# EAGLE board fmc-host (EAGLE 8.3.2), part 1 of 3
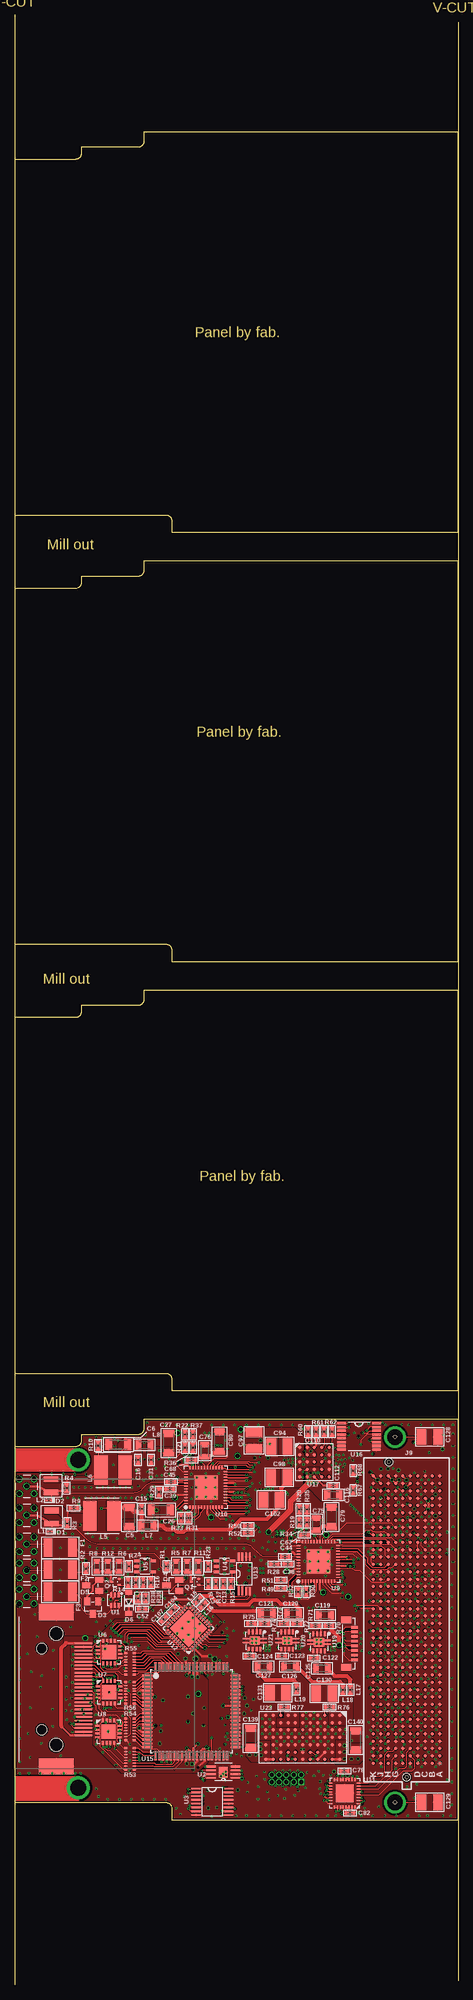
[diagram p9: board, top side]
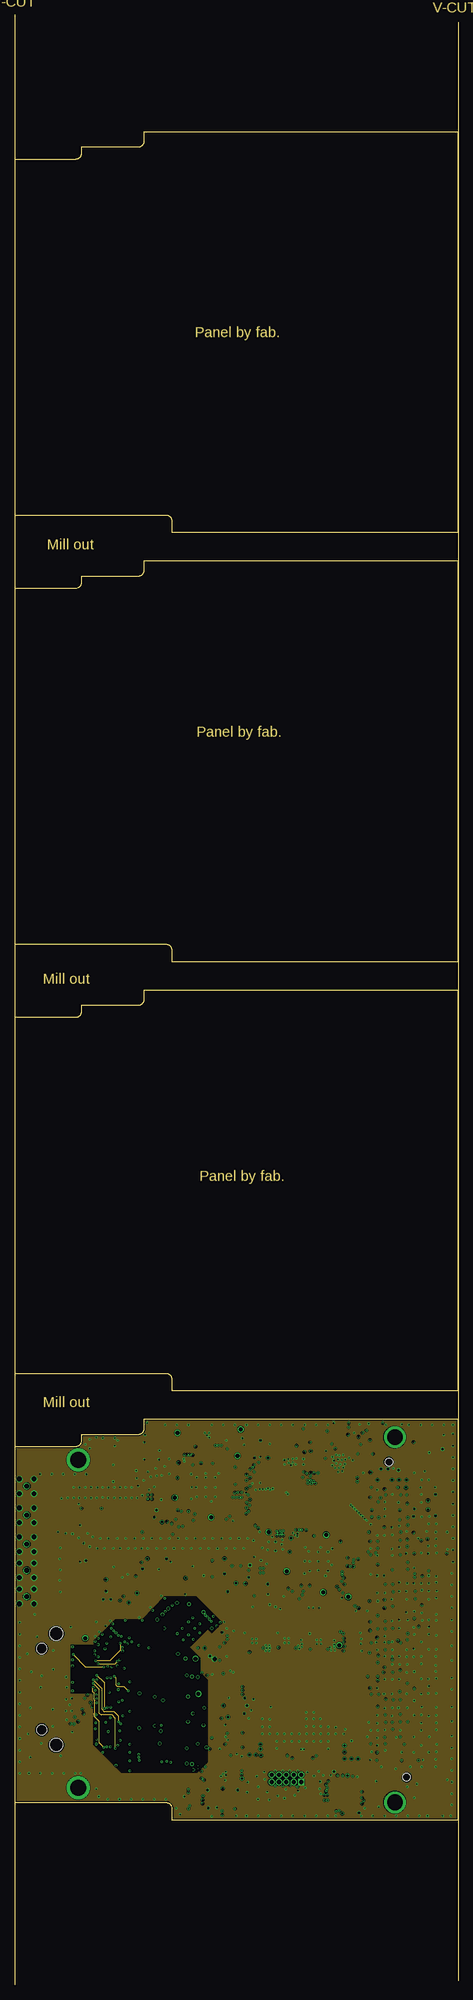
[diagram p10: board, inner layer GND1]
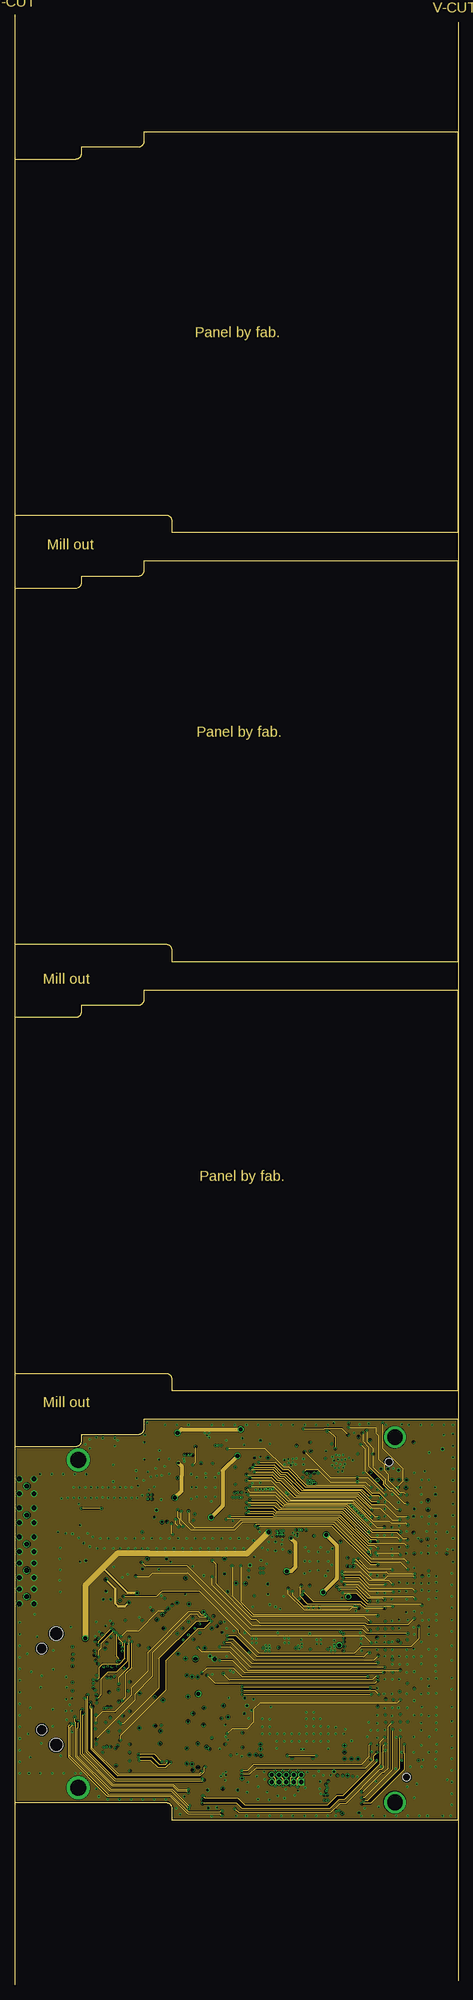
[diagram p11: board, inner layer Highspeed2]
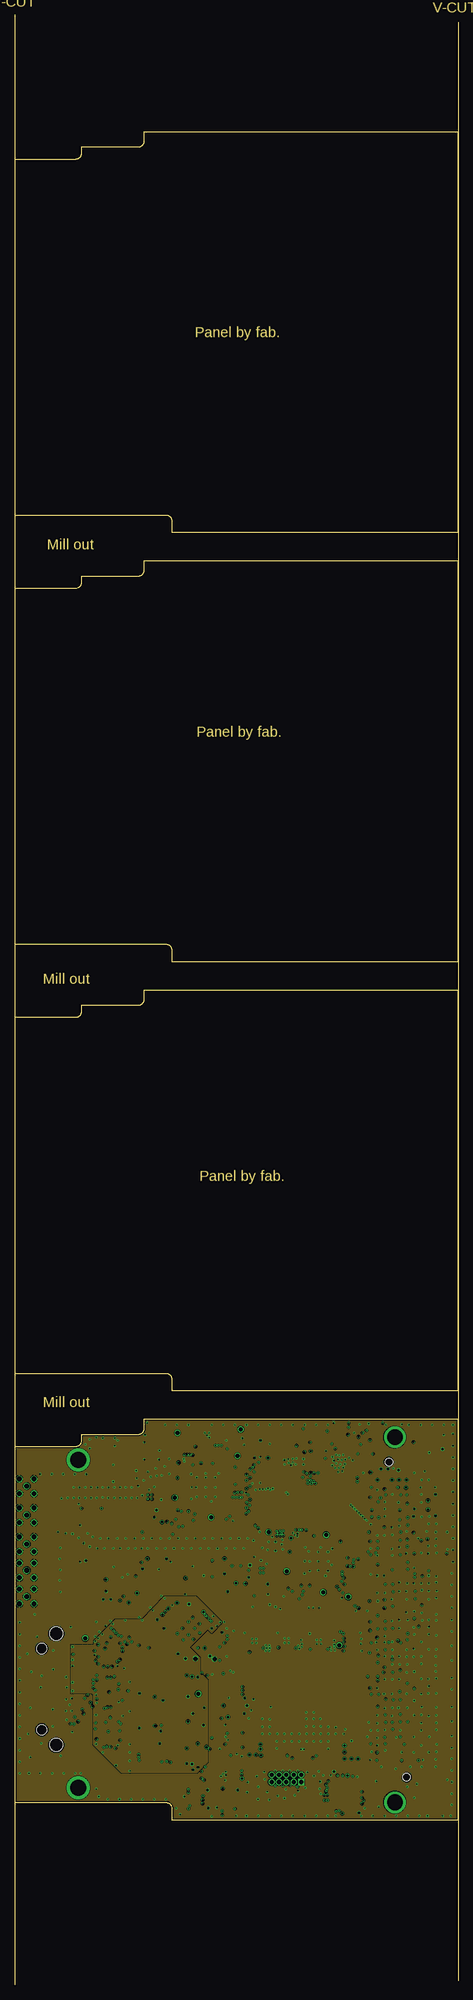
[diagram p12: board, inner layer GND3]
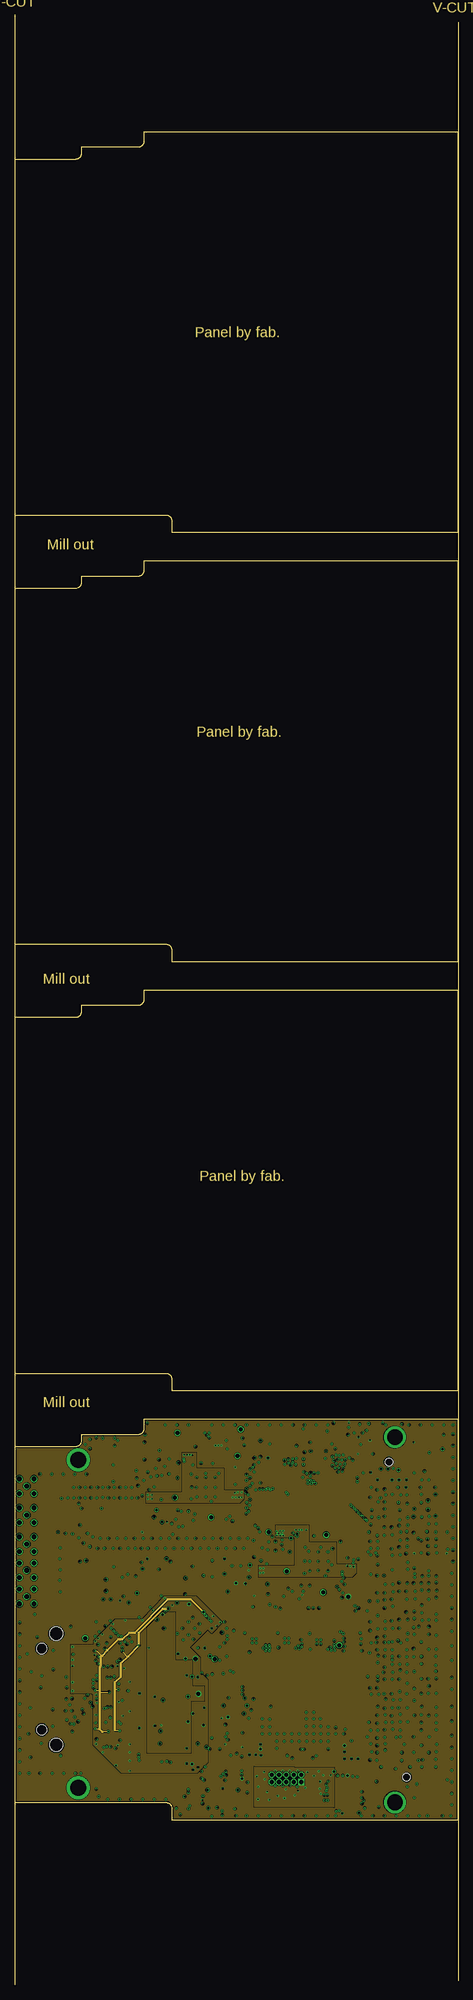
[diagram p13: board, inner layer VCC]
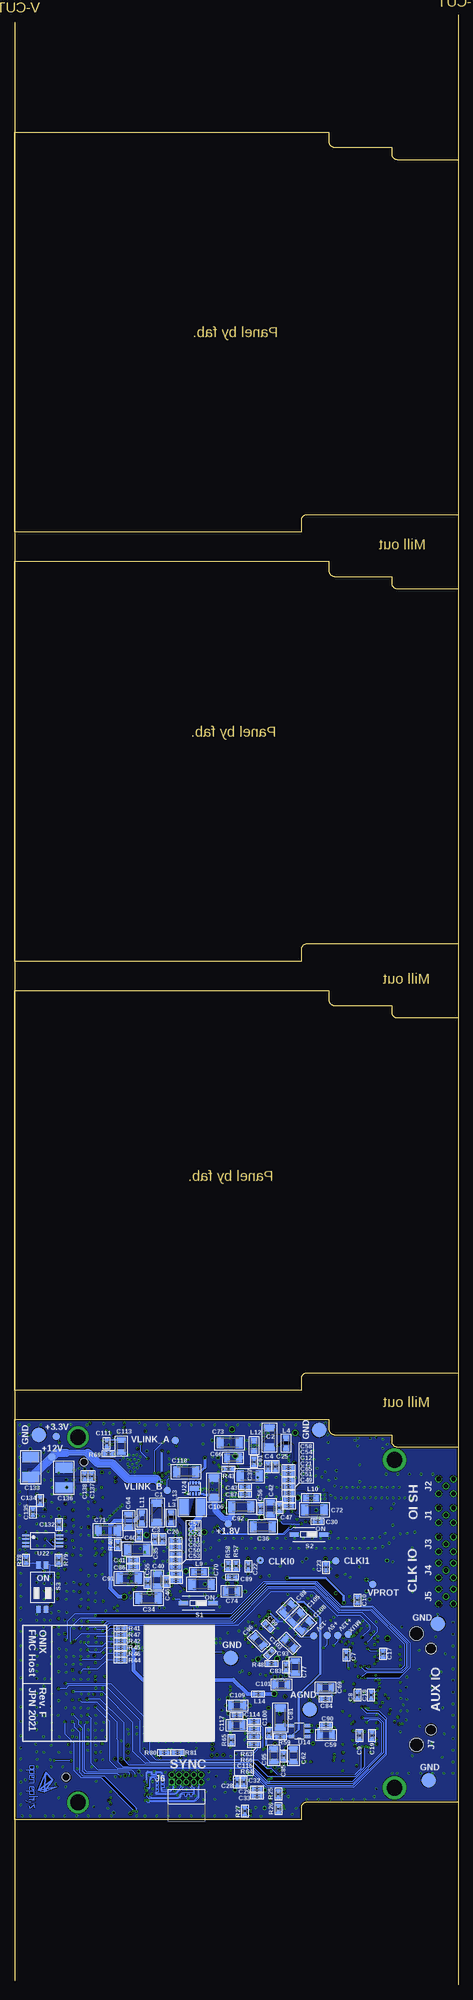
[diagram p14: board, bottom side, seen from below]

Size 76.5 x 339.8 mm. Coordinates in mm from the lower left corner, seen from the top.
Outline: 0,339.8 0,0
Outline: 76.5,338.5 76.5,0.7
Outline: 76.5,102.5 76.5,171.5 22.3,171.5 22.3,169.9 arc-90 21.3,168.9 11.5,168.9 11.5,167.8 arc-90 10.5,166.8 0,166.8 0,105.5 26.1,105.5 arc-90 27.1,104.5 27.1,102.5 76.5,102.5
Outline: 76.5,176.5 76.5,245.5 22.3,245.5 22.3,243.9 arc-90 21.3,242.9 11.5,242.9 11.5,241.8 arc-90 10.5,240.8 0,240.8 0,179.5 26.1,179.5 arc-90 27.1,178.5 27.1,176.5 76.5,176.5
Outline: 76.5,250.5 76.5,319.5 22.3,319.5 22.3,317.9 arc-90 21.3,316.9 11.5,316.9 11.5,315.8 arc-90 10.5,314.8 0,314.8 0,253.5 26.1,253.5 arc-90 27.1,252.5 27.1,250.5 76.5,250.5
Copper layers (1+2*3+4*5+16): Top/HighSpeed 0.035mm / dielectric 0.1mm / GND1 0.0175mm / dielectric 0.565mm / Highspeed2 0.0175mm / dielectric 5mil / GND3 0.0175mm / dielectric 0.565mm / VCC 0.0175mm / dielectric 0.1mm / Bottom/LowSpeed 0.035mm
Design rules "jlcpcb-6-layer *": minimum track width 3.5mil, minimum drill 0.2mm, track to track 3.5mil, track to pad 3.5mil, pad to pad 3.5mil, via to via 5mil, smd to smd 0mil, copper to edge 0.2mm, drill to drill 5mil, minimum pad ring 3mil, minimum via ring 3mil, stop-mask expansion 0mil, vias tented up to drill 100mil, thermal gap 0.12mm
Net classes: 1 130 Ohm Diff Top: width 0.09 mm, drill 0.2 mm, clearance 0.089 mm; 2 50 Ohm Single Top: width 0.15 mm, drill 0.2 mm; 3 100 Ohm Diff Mid: width 0.19 mm, drill 0.2 mm, clearance 0.09 mm; 4 50 Ohm Single Mid: width 0.2 mm, drill 0.2 mm; 5 100 Ohm Diff Top: width 0.15 mm, drill 0.2 mm, clearance 0.09 mm; 6 Link: width 0.15 mm, drill 0.2 mm, clearance 0.5 mm; 7 CAN 210 Diff Top: width 0.11 mm, drill 0.2 mm, clearance 0.09 mm
tRestrict: area -0.1,31.4 to 11.2,36.2; area 8.8,31.8 to 13.2,36.2; area 8.9,88.4 to 13.1,92.6; area -0.1,88.4 to 11.2,92.8; area 63.6,29.5 to 67.6,33.5; area 63.6,92.5 to 67.6,96.5

## Footprints (pad centres in the part's own frame; a part is rotated, then mirrored left to right if it is on the bottom)
1206 = smd 1.219 x 1.88: 1 -1.651,0; 2 1.651,0
0402 = smd 0.686 x 0.762: 1 -0.533,0; 2 0.533,0
0805 = smd 0.965 x 1.524: 1 -1.041,0; 2 1.041,0
1210 = smd 1.651 x 2.794: 1 -1.397,0; 2 1.397,0
1411-VISHAY-B = smd 1.8 x 3: A -1.725,0; C 1.725,0
0402P-DFN = smd 0.35 x 0.6: A -0.325,0; C 0.325,0
SOT23 = smd 1 x 1.4: 1 -0.95,-1.1; 2 0.95,-1.1; 3 0,1.1
SOD123 = smd 0.914 x 1.219: A -1.8,0; C 1.8,0
1812 = smd 1.5 x 3.2: 1 -2.1,0; 2 2.1,0
MMCX-THRU = drill 0.8: GND@1 -1.27,1.27; GND@2 -1.27,-1.27; GND@3 1.27,-1.27; GND@4 1.27,1.27; SIG 0,0
FTSH-105-01-F-D-RA-K = drill 0.71 pad 1.06 square: 01 2.54,0.635 | drill 0.71 pad 1.06: 02 2.54,-0.635; 03 1.27,0.635; 04 1.27,-0.635; 05 0,0.635; 06 0,-0.635; 07 -1.27,0.635; 08 -1.27,-0.635; 09 -2.54,0.635; 10 -2.54,-0.635
12226-82X0-00XX = smd 0.335 x 3: 1 7.938,7.2; 2 6.668,7.2; 3 5.397,7.2; 4 4.128,7.2; 5 2.857,7.2; 6 1.587,7.2; 7 0.318,7.2; 8 -0.953,7.2; 9 -2.223,7.2; 10 -3.493,7.2; 11 -4.763,7.2; 12 -6.032,7.2; 13 -7.303,7.2; 14 7.303,7.2; 15 6.032,7.2; 16 4.763,7.2; 17 3.493,7.2; 18 2.223,7.2; 19 0.953,7.2; 20 -0.318,7.2; 21 -1.587,7.2; 22 -2.857,7.2; 23 -4.128,7.2; 24 -5.397,7.2; 25 -6.668,7.2; 26 -7.938,7.2 | smd 2.8 x 6: PAD1 -13.3,2.5; PAD2 13.3,2.5 | hole 1.8: 7,0; -7,0 | hole 2.3: 9.6,2.5; -9.6,2.5
FMC_SINGLE_WIDTH_MODULE = drill 2.7 pad 4: BEZ1 -54.6,59.05; BEZ2 -54.6,2.5
FMC_HPC_MALE = smd 0.635 x 0.635: A1 24.765,5.715; A2 23.495,5.715; A3 22.225,5.715; A4 20.955,5.715; A5 19.685,5.715; A6 18.415,5.715; A7 17.145,5.715; A8 15.875,5.715; A9 14.605,5.715; A10 13.335,5.715; A11 12.065,5.715; A12 10.795,5.715; A13 9.525,5.715; A14 8.255,5.715; A15 6.985,5.715; A16 5.715,5.715; A17 4.445,5.715; A18 3.175,5.715; A19 1.905,5.715; A20 0.635,5.715; A21 -0.635,5.715; A22 -1.905,5.715; A23 -3.175,5.715; A24 -4.445,5.715; A25 -5.715,5.715; A26 -6.985,5.715; A27 -8.255,5.715; A28 -9.525,5.715; A29 -10.795,5.715; A30 -12.065,5.715; A31 -13.335,5.715; A32 -14.605,5.715; A33 -15.875,5.715; A34 -17.145,5.715; A35 -18.415,5.715; A36 -19.685,5.715; A37 -20.955,5.715; A38 -22.225,5.715; A39 -23.495,5.715; A40 -24.765,5.715; B1 24.765,4.445; B2 23.495,4.445; B3 22.225,4.445; B4 20.955,4.445; B5 19.685,4.445; B6 18.415,4.445; B7 17.145,4.445; B8 15.875,4.445; B9 14.605,4.445; B10 13.335,4.445; B11 12.065,4.445; B12 10.795,4.445; B13 9.525,4.445; B14 8.255,4.445; B15 6.985,4.445; B16 5.715,4.445; B17 4.445,4.445; B18 3.175,4.445; B19 1.905,4.445; B20 0.635,4.445; B21 -0.635,4.445; B22 -1.905,4.445; B23 -3.175,4.445; B24 -4.445,4.445; B25 -5.715,4.445; B26 -6.985,4.445; B27 -8.255,4.445; B28 -9.525,4.445; B29 -10.795,4.445; B30 -12.065,4.445; B31 -13.335,4.445; B32 -14.605,4.445; B33 -15.875,4.445; B34 -17.145,4.445; B35 -18.415,4.445; B36 -19.685,4.445; B37 -20.955,4.445; B38 -22.225,4.445; B39 -23.495,4.445; B40 -24.765,4.445; C1 24.765,3.175; C2 23.495,3.175; C3 22.225,3.175; C4 20.955,3.175; C5 19.685,3.175; C6 18.415,3.175; C7 17.145,3.175; C8 15.875,3.175; C9 14.605,3.175; C10 13.335,3.175; C11 12.065,3.175; C12 10.795,3.175; C13 9.525,3.175; C14 8.255,3.175; C15 6.985,3.175; C16 5.715,3.175; C17 4.445,3.175; C18 3.175,3.175; C19 1.905,3.175; C20 0.635,3.175; C21 -0.635,3.175; C22 -1.905,3.175; C23 -3.175,3.175; C24 -4.445,3.175; C25 -5.715,3.175; C26 -6.985,3.175; C27 -8.255,3.175; C28 -9.525,3.175; C29 -10.795,3.175; C30 -12.065,3.175; C31 -13.335,3.175; C32 -14.605,3.175; C33 -15.875,3.175; C34 -17.145,3.175; C35 -18.415,3.175; C36 -19.685,3.175; C37 -20.955,3.175; C38 -22.225,3.175; C39 -23.495,3.175; C40 -24.765,3.175; D1 24.765,1.905; D2 23.495,1.905; D3 22.225,1.905; D4 20.955,1.905; D5 19.685,1.905; D6 18.415,1.905; D7 17.145,1.905; D8 15.875,1.905; D9 14.605,1.905; D10 13.335,1.905; D11 12.065,1.905; D12 10.795,1.905; D13 9.525,1.905; D14 8.255,1.905; D15 6.985,1.905; D16 5.715,1.905; D17 4.445,1.905; D18 3.175,1.905; D19 1.905,1.905; D20 0.635,1.905; D21 -0.635,1.905; D22 -1.905,1.905; D23 -3.175,1.905; D24 -4.445,1.905; D25 -5.715,1.905; D26 -6.985,1.905; D27 -8.255,1.905; D28 -9.525,1.905; D29 -10.795,1.905; D30 -12.065,1.905; D31 -13.335,1.905; D32 -14.605,1.905; D33 -15.875,1.905; D34 -17.145,1.905; D35 -18.415,1.905; D36 -19.685,1.905; D37 -20.955,1.905; D38 -22.225,1.905; D39 -23.495,1.905; D40 -24.765,1.905; E1 24.765,0.635; E2 23.495,0.635; E3 22.225,0.635; E4 20.955,0.635; E5 19.685,0.635; E6 18.415,0.635; E7 17.145,0.635; E8 15.875,0.635; E9 14.605,0.635; E10 13.335,0.635; E11 12.065,0.635; E12 10.795,0.635; E13 9.525,0.635; E14 8.255,0.635; E15 6.985,0.635; E16 5.715,0.635; E17 4.445,0.635; E18 3.175,0.635; E19 1.905,0.635; E20 0.635,0.635; E21 -0.635,0.635; E22 -1.905,0.635; E23 -3.175,0.635; E24 -4.445,0.635; E25 -5.715,0.635; E26 -6.985,0.635; E27 -8.255,0.635; E28 -9.525,0.635; E29 -10.795,0.635; E30 -12.065,0.635; E31 -13.335,0.635; E32 -14.605,0.635; E33 -15.875,0.635; E34 -17.145,0.635; E35 -18.415,0.635; E36 -19.685,0.635; E37 -20.955,0.635; E38 -22.225,0.635; E39 -23.495,0.635; E40 -24.765,0.635; F1 24.765,-0.635; F2 23.495,-0.635; F3 22.225,-0.635; F4 20.955,-0.635; F5 19.685,-0.635; F6 18.415,-0.635; F7 17.145,-0.635; F8 15.875,-0.635; F9 14.605,-0.635; F10 13.335,-0.635; F11 12.065,-0.635; F12 10.795,-0.635; F13 9.525,-0.635; F14 8.255,-0.635; F15 6.985,-0.635; F16 5.715,-0.635; F17 4.445,-0.635; F18 3.175,-0.635; F19 1.905,-0.635; F20 0.635,-0.635; F21 -0.635,-0.635; F22 -1.905,-0.635; F23 -3.175,-0.635; F24 -4.445,-0.635; F25 -5.715,-0.635; F26 -6.985,-0.635; F27 -8.255,-0.635; F28 -9.525,-0.635; F29 -10.795,-0.635; F30 -12.065,-0.635; F31 -13.335,-0.635; F32 -14.605,-0.635; F33 -15.875,-0.635; F34 -17.145,-0.635; F35 -18.415,-0.635; F36 -19.685,-0.635; F37 -20.955,-0.635; F38 -22.225,-0.635; F39 -23.495,-0.635; F40 -24.765,-0.635; G1 24.765,-1.905; G2 23.495,-1.905; G3 22.225,-1.905; G4 20.955,-1.905; G5 19.685,-1.905; G6 18.415,-1.905; G7 17.145,-1.905; G8 15.875,-1.905; G9 14.605,-1.905; G10 13.335,-1.905; G11 12.065,-1.905; G12 10.795,-1.905; G13 9.525,-1.905; G14 8.255,-1.905; G15 6.985,-1.905; G16 5.715,-1.905; G17 4.445,-1.905; G18 3.175,-1.905; G19 1.905,-1.905; G20 0.635,-1.905; G21 -0.635,-1.905; G22 -1.905,-1.905; G23 -3.175,-1.905; G24 -4.445,-1.905; G25 -5.715,-1.905; G26 -6.985,-1.905; G27 -8.255,-1.905; G28 -9.525,-1.905; G29 -10.795,-1.905; G30 -12.065,-1.905; G31 -13.335,-1.905; G32 -14.605,-1.905; G33 -15.875,-1.905; G34 -17.145,-1.905; G35 -18.415,-1.905; G36 -19.685,-1.905; G37 -20.955,-1.905; G38 -22.225,-1.905; G39 -23.495,-1.905; G40 -24.765,-1.905; H1 24.765,-3.175; H2 23.495,-3.175; H3 22.225,-3.175; H4 20.955,-3.175; H5 19.685,-3.175; H6 18.415,-3.175; H7 17.145,-3.175; H8 15.875,-3.175; H9 14.605,-3.175; H10 13.335,-3.175; H11 12.065,-3.175; H12 10.795,-3.175; H13 9.525,-3.175; H14 8.255,-3.175; H15 6.985,-3.175; H16 5.715,-3.175; H17 4.445,-3.175; H18 3.175,-3.175; H19 1.905,-3.175; H20 0.635,-3.175; H21 -0.635,-3.175; H22 -1.905,-3.175; H23 -3.175,-3.175; H24 -4.445,-3.175; H25 -5.715,-3.175; H26 -6.985,-3.175; H27 -8.255,-3.175; H28 -9.525,-3.175; H29 -10.795,-3.175; H30 -12.065,-3.175; H31 -13.335,-3.175; H32 -14.605,-3.175; H33 -15.875,-3.175; H34 -17.145,-3.175; H35 -18.415,-3.175; H36 -19.685,-3.175; H37 -20.955,-3.175; H38 -22.225,-3.175; H39 -23.495,-3.175; H40 -24.765,-3.175; J1 24.765,-4.445; J2 23.495,-4.445; J3 22.225,-4.445; J4 20.955,-4.445; J5 19.685,-4.445; J6 18.415,-4.445; J7 17.145,-4.445; J8 15.875,-4.445; J9 14.605,-4.445; J10 13.335,-4.445; J11 12.065,-4.445; J12 10.795,-4.445; J13 9.525,-4.445; J14 8.255,-4.445; J15 6.985,-4.445; J16 5.715,-4.445; J17 4.445,-4.445; J18 3.175,-4.445; J19 1.905,-4.445; J20 0.635,-4.445; J21 -0.635,-4.445; J22 -1.905,-4.445; J23 -3.175,-4.445; J24 -4.445,-4.445; J25 -5.715,-4.445; J26 -6.985,-4.445; J27 -8.255,-4.445; J28 -9.525,-4.445; J29 -10.795,-4.445; J30 -12.065,-4.445; J31 -13.335,-4.445; J32 -14.605,-4.445; J33 -15.875,-4.445; J34 -17.145,-4.445; J35 -18.415,-4.445; J36 -19.685,-4.445; J37 -20.955,-4.445; J38 -22.225,-4.445; J39 -23.495,-4.445; J40 -24.765,-4.445; K1 24.765,-5.715; K2 23.495,-5.715; K3 22.225,-5.715; K4 20.955,-5.715; K5 19.685,-5.715; K6 18.415,-5.715; K7 17.145,-5.715; K8 15.875,-5.715; K9 14.605,-5.715; K10 13.335,-5.715; K11 12.065,-5.715; K12 10.795,-5.715; K13 9.525,-5.715; K14 8.255,-5.715; K15 6.985,-5.715; K16 5.715,-5.715; K17 4.445,-5.715; K18 3.175,-5.715; K19 1.905,-5.715; K20 0.635,-5.715; K21 -0.635,-5.715; K22 -1.905,-5.715; K23 -3.175,-5.715; K24 -4.445,-5.715; K25 -5.715,-5.715; K26 -6.985,-5.715; K27 -8.255,-5.715; K28 -9.525,-5.715; K29 -10.795,-5.715; K30 -12.065,-5.715; K31 -13.335,-5.715; K32 -14.605,-5.715; K33 -15.875,-5.715; K34 -17.145,-5.715; K35 -18.415,-5.715; K36 -19.685,-5.715; K37 -20.955,-5.715; K38 -22.225,-5.715; K39 -23.495,-5.715; K40 -24.765,-5.715 | drill 2.692: CHASSIS_A -31.496,-2.032; CHASSIS_B 31.496,-2.032 | hole 1.321: 27.165,0; -27.191,-3.05
BM08B-SURS-TF = smd 0.5 x 1.1: 1 -2.8,0; 2 -2,0; 3 -1.2,0; 4 -0.4,0; 5 0.4,0; 6 1.2,0; 7 2,0; 8 2.8,0 | smd 1.2 x 1.7: M1 -4.1,1.4; M2 4.1,1.4
1008PS = smd 2.54 x 1.016: 1 0,1.143; 2 0,-1.143
0603 = smd 0.889 x 1.067: 1 -0.864,0; 2 0.864,0
SRN6045TA = smd 5.1 x 2.35: 1 0,2.075; 2 0,-2.075
SC75 = smd 0.356 x 0.503: 1 -0.508,-0.65; 2 0.508,-0.65; 3 0,0.65
RN2X8-1506 = smd 0.425 x 0.5: 1 -1.837,-0.75; 8 1.837,-0.75; C1 -1.837,0.75; C8 1.837,0.75 | smd 0.25 x 0.5: 2 -1.25,-0.75; 3 -0.75,-0.75; 4 -0.25,-0.75; 5 0.25,-0.75; 6 0.75,-0.75; 7 1.25,-0.75; C2 -1.25,0.75; C3 -0.75,0.75; C4 -0.25,0.75; C5 0.25,0.75; C6 0.75,0.75; C7 1.25,0.75
DIP01-SMD-GULL = smd 0.76 x 1.6: 1 0,-5.08; 2 0,0
CHS-02TB = smd 0.76 x 1.27: 1 -0.635,-3.81; 2 0.635,-3.81; 3 0.635,3.81; 4 -0.635,3.81
B1,27 = smd 1.27 x 1.27: TP 0,0
B2,54 = smd 2.54 x 2.54: TP 0,0
SC70 = smd 0.35 x 0.85: 1 -0.65,-0.9; 2 0,-0.9; 3 0.65,-0.9; 4 0.65,0.9; 5 0,0.9; 6 -0.65,0.9
MSOP-8-PAD-3X3 = smd 1.6 x 0.4: 1 -2.1,0.975; 2 -2.1,0.325; 3 -2.1,-0.325; 4 -2.1,-0.975; 5 2.1,-0.975; 6 2.1,-0.325; 7 2.1,0.325; 8 2.1,0.975 | smd 1.57 x 1.89: PAD 0,0
TSSOP-16 = smd 1.6 x 0.3: 1 -2.8,2.275; 2 -2.8,1.625; 3 -2.8,0.975; 4 -2.8,0.325; 5 -2.8,-0.325; 6 -2.8,-0.975; 7 -2.8,-1.625; 8 -2.8,-2.275; 9 2.8,-2.275; 10 2.8,-1.625; 11 2.8,-0.975; 12 2.8,-0.325; 13 2.8,0.325; 14 2.8,0.975; 15 2.8,1.625; 16 2.8,2.275
SOT-23-5 = smd 0.55 x 1: 1 -0.95,-1.35; 2 0,-1.35; 3 0.95,-1.35; 4 0.95,1.35; 5 -0.95,1.35
QFN16-4X4MM = smd 0.686 x 0.33: 1 -1.925,0.975; 2 -1.925,0.325; 3 -1.925,-0.325; 4 -1.925,-0.975; 9 1.925,-0.975; 10 1.925,-0.325; 11 1.925,0.325; 12 1.925,0.975 | smd 0.33 x 0.686: 5 -0.975,-1.925; 6 -0.325,-1.925; 7 0.325,-1.925; 8 0.975,-1.925; 13 0.975,1.925; 14 0.325,1.925; 15 -0.325,1.925; 16 -0.975,1.925 | smd 2.5 x 2.5: PAD 0,0
WQFN48-7X7-PAD = smd 0.24 x 0.6: 1 2.75,3.4; 2 2.25,3.4; 3 1.75,3.4; 4 1.25,3.4; 5 0.75,3.4; 6 0.25,3.4; 7 -0.25,3.4; 8 -0.75,3.4; 9 -1.25,3.4; 10 -1.75,3.4; 11 -2.25,3.4; 12 -2.75,3.4; 25 -2.75,-3.4; 26 -2.25,-3.4; 27 -1.75,-3.4; 28 -1.25,-3.4; 29 -0.75,-3.4; 30 -0.25,-3.4; 31 0.25,-3.4; 32 0.75,-3.4; 33 1.25,-3.4; 34 1.75,-3.4; 35 2.25,-3.4; 36 2.75,-3.4 | smd 0.6 x 0.24: 13 -3.4,2.75; 14 -3.4,2.25; 15 -3.4,1.75; 16 -3.4,1.25; 17 -3.4,0.75; 18 -3.4,0.25; 19 -3.4,-0.25; 20 -3.4,-0.75; 21 -3.4,-1.25; 22 -3.4,-1.75; 23 -3.4,-2.25; 24 -3.4,-2.75; 37 3.4,-2.75; 38 3.4,-2.25; 39 3.4,-1.75; 40 3.4,-1.25; 41 3.4,-0.75; 42 3.4,-0.25; 43 3.4,0.25; 44 3.4,0.75; 45 3.4,1.25; 46 3.4,1.75; 47 3.4,2.25; 48 3.4,2.75 | smd 4.1 x 4.1: PAD 0,0
WQFN32-5X5 = smd 0.25 x 0.6: 1 1.75,2.4; 2 1.25,2.4; 3 0.75,2.4; 4 0.25,2.4; 5 -0.25,2.4; 6 -0.75,2.4; 7 -1.25,2.4; 8 -1.75,2.4; 17 -1.75,-2.4; 18 -1.25,-2.4; 19 -0.75,-2.4; 20 -0.25,-2.4; 21 0.25,-2.4; 22 0.75,-2.4; 23 1.25,-2.4; 24 1.75,-2.4 | smd 0.6 x 0.25: 9 -2.4,1.75; 10 -2.4,1.25; 11 -2.4,0.75; 12 -2.4,0.25; 13 -2.4,-0.25; 14 -2.4,-0.75; 15 -2.4,-1.25; 16 -2.4,-1.75; 25 2.4,-1.75; 26 2.4,-1.25; 27 2.4,-0.75; 28 2.4,-0.25; 29 2.4,0.25; 30 2.4,0.75; 31 2.4,1.25; 32 2.4,1.75 | smd 3.1 x 3.1: PAD 0,0
CP_40_7 = smd 0.855 x 0.3: 1 -2.927,2.25; 2 -2.927,1.75; 3 -2.927,1.25; 4 -2.927,0.75; 5 -2.927,0.25; 6 -2.927,-0.25; 7 -2.927,-0.75; 8 -2.927,-1.25; 9 -2.927,-1.75; 10 -2.927,-2.25; 21 2.927,-2.25; 22 2.927,-1.75; 23 2.927,-1.25; 24 2.927,-0.75; 25 2.927,-0.25; 26 2.927,0.25; 27 2.927,0.75; 28 2.927,1.25; 29 2.927,1.75; 30 2.927,2.25 | smd 0.3 x 0.855: 11 -2.25,-2.927; 12 -1.75,-2.927; 13 -1.25,-2.927; 14 -0.75,-2.927; 15 -0.25,-2.927; 16 0.25,-2.927; 17 0.75,-2.927; 18 1.25,-2.927; 19 1.75,-2.927; 20 2.25,-2.927; 31 2.25,2.927; 32 1.75,2.927; 33 1.25,2.927; 34 0.75,2.927; 35 0.25,2.927; 36 -0.25,2.927; 37 -0.75,2.927; 38 -1.25,2.927; 39 -1.75,2.927; 40 -2.25,2.927 | smd 4.6 x 4.6: PAD 0,0
TSSOP-8 = smd 0.348 x 1.45: 1 -0.973,-2.95; 2 -0.323,-2.95; 3 0.327,-2.95; 4 0.977,-2.95; 5 0.977,2.95; 6 0.327,2.95; 7 -0.323,2.95; 8 -0.973,2.95
ST_80_2 = smd 1.661 x 0.432: 1 -7.625,6.175; 2 -7.625,5.525; 3 -7.625,4.875; 4 -7.625,4.225; 5 -7.625,3.575; 6 -7.625,2.925; 7 -7.625,2.275; 8 -7.625,1.625; 9 -7.625,0.975; 10 -7.625,0.325; 11 -7.625,-0.325; 12 -7.625,-0.975; 13 -7.625,-1.625; 14 -7.625,-2.275; 15 -7.625,-2.925; 16 -7.625,-3.575; 17 -7.625,-4.225; 18 -7.625,-4.875; 19 -7.625,-5.525; 20 -7.625,-6.175; 41 7.625,-6.175; 42 7.625,-5.525; 43 7.625,-4.875; 44 7.625,-4.225; 45 7.625,-3.575; 46 7.625,-2.925; 47 7.625,-2.275; 48 7.625,-1.625; 49 7.625,-0.975; 50 7.625,-0.325; 51 7.625,0.325; 52 7.625,0.975; 53 7.625,1.625; 54 7.625,2.275; 55 7.625,2.925; 56 7.625,3.575; 57 7.625,4.225; 58 7.625,4.875; 59 7.625,5.525; 60 7.625,6.175 | smd 0.432 x 1.661: 21 -6.175,-7.625; 22 -5.525,-7.625; 23 -4.875,-7.625; 24 -4.225,-7.625; 25 -3.575,-7.625; 26 -2.925,-7.625; 27 -2.275,-7.625; 28 -1.625,-7.625; 29 -0.975,-7.625; 30 -0.325,-7.625; 31 0.325,-7.625; 32 0.975,-7.625; 33 1.625,-7.625; 34 2.275,-7.625; 35 2.925,-7.625; 36 3.575,-7.625; 37 4.225,-7.625; 38 4.875,-7.625; 39 5.525,-7.625; 40 6.175,-7.625; 61 6.175,7.625; 62 5.525,7.625; 63 4.875,7.625; 64 4.225,7.625; 65 3.575,7.625; 66 2.925,7.625; 67 2.275,7.625; 68 1.625,7.625; 69 0.975,7.625; 70 0.325,7.625; 71 -0.325,7.625; 72 -0.975,7.625; 73 -1.625,7.625; 74 -2.275,7.625; 75 -2.925,7.625; 76 -3.575,7.625; 77 -4.225,7.625; 78 -4.875,7.625; 79 -5.525,7.625; 80 -6.175,7.625
TSSOP-16_4.4X5.0 = smd 1.475 x 0.45: 1 -3,2.275; 2 -3,1.625; 3 -3,0.975; 4 -3,0.325; 5 -3,-0.325; 6 -3,-0.975; 7 -3,-1.625; 8 -3,-2.275; 9 3,-2.275; 10 3,-1.625; 11 3,-0.975; 12 3,-0.325; 13 3,0.325; 14 3,0.975; 15 3,1.625; 16 3,2.275
BGA_5X5_625X625 = smd 0.635 x 0.635: A1 -2.54,2.54; A2 -1.27,2.54; A3 0,2.54; A4 1.27,2.54; A5 2.54,2.54; B1 -2.54,1.27; B2 -1.27,1.27; B3 0,1.27; B4 1.27,1.27; B5 2.54,1.27; C1 -2.54,0; C2 -1.27,0; C3 0,0; C4 1.27,0; C5 2.54,0; D1 -2.54,-1.27; D2 -1.27,-1.27; D3 0,-1.27; D4 1.27,-1.27; D5 2.54,-1.27; E1 -2.54,-2.54; E2 -1.27,-2.54; E3 0,-2.54; E4 1.27,-2.54; E5 2.54,-2.54
PVSON-N8+4-3X3 = smd 0.85 x 0.35: 1 -1.475,0.975; 2 -1.475,0.325; 3 -1.475,-0.325; 4 -1.475,-0.975; 5 1.475,-0.975; 6 1.475,-0.325; 7 1.475,0.325; 8 1.475,0.975 | smd 1.5 x 1.75: PAD1 0,0 | smd 0.28 x 1.205: PAD2 -0.325,-1.45; PAD3 -0.325,1.45; PAD4 0.325,1.45; PAD5 0.325,-1.45
TSSOP8 = smd 0.35 x 1.2: 1 -0.975,-2.925; 2 -0.325,-2.925; 3 0.325,-2.925; 4 0.975,-2.925; 5 0.975,2.925; 6 0.325,2.925; 7 -0.325,2.925; 8 -0.975,2.925
LTM8049 = smd 0.63 x 0.63: A1 -3.81,6.35; A2 -2.54,6.35; A3 -1.27,6.35; A4 0,6.35; A5 1.27,6.35; A6 2.54,6.35; A7 3.81,6.35; B1 -3.81,5.08; B2 -2.54,5.08; B3 -1.27,5.08; B4 0,5.08; B5 1.27,5.08; B6 2.54,5.08; B7 3.81,5.08; C1 -3.81,3.81; C2 -2.54,3.81; C3 -1.27,3.81; C4 0,3.81; C5 1.27,3.81; C6 2.54,3.81; C7 3.81,3.81; D1 -3.81,2.54; D2 -2.54,2.54; D3 -1.27,2.54; D4 0,2.54; D5 1.27,2.54; D6 2.54,2.54; D7 3.81,2.54; E1 -3.81,1.27; E2 -2.54,1.27; E3 -1.27,1.27; E4 0,1.27; E5 1.27,1.27; E6 2.54,1.27; E7 3.81,1.27; F1 -3.81,0; F2 -2.54,0; F3 -1.27,0; F4 0,0; F5 1.27,0; F6 2.54,0; F7 3.81,0; G1 -3.81,-1.27; G2 -2.54,-1.27; G3 -1.27,-1.27; G4 0,-1.27; G5 1.27,-1.27; G6 2.54,-1.27; G7 3.81,-1.27; H1 -3.81,-2.54; H2 -2.54,-2.54; H3 -1.27,-2.54; H4 0,-2.54; H5 1.27,-2.54; H6 2.54,-2.54; H7 3.81,-2.54; J1 -3.81,-3.81; J2 -2.54,-3.81; J3 -1.27,-3.81; J4 0,-3.81; J5 1.27,-3.81; J6 2.54,-3.81; J7 3.81,-3.81; K1 -3.81,-5.08; K2 -2.54,-5.08; K3 -1.27,-5.08; K4 0,-5.08; K5 1.27,-5.08; K6 2.54,-5.08; K7 3.81,-5.08; L1 -3.81,-6.35; L2 -2.54,-6.35; L3 -1.27,-6.35; L4 0,-6.35; L5 1.27,-6.35; L6 2.54,-6.35; L7 3.81,-6.35
WSON8-2X2 = smd 0.5 x 0.25: 1 -0.95,0.75; 2 -0.95,0.25; 3 -0.95,-0.25; 4 -0.95,-0.75; 5 0.95,-0.75; 6 0.95,-0.25; 7 0.95,0.25; 8 0.95,0.75 | smd 0.9 x 1.6: PAD 0,0

## Placement (x,y rotation side)
C1  10uF  [1206]  51.95,81.45 270 bottom
C2  10uF  [1206]  32.55,94.4 270 bottom
C3  0.1uF  [0402]  52.25,76.85 90 bottom
C4  0.1uF  [0402]  32.8,89.4 90 bottom
C5  10uF  [1206]  19.8,80.7 90 top
C6  10uF  [1206]  17.9,93.2 0 top
C7  0.1uF  [0402]  19.3,56.9 90 bottom
C8  0.1uF  [0402]  17.4,50 90 bottom
C9  0.1uF  [0402]  17,43 90 bottom
C10  0.1uF  [0402]  17.4,66.4 270 bottom
C11  10nF  [0402]  48.75,73.25 0 bottom
C12  10nF  [0402]  29.25,87.05 0 bottom
C13  0.1uF  [0402]  36,69.2 270 top
C14  0.1uF  [0402]  22.2,69.4 270 top
C15  0.1uF  [0402]  21.9,82.1 90 top
C16  0.1uF  [0402]  21.33,90.55 270 top
C17  0.1uF  [0402]  13,57.1 90 bottom
C18  0.1uF  [0402]  15,50 90 bottom
C19  0.1uF  [0402]  14.9,43 90 bottom
C20  10nF  [0402]  51,76.85 90 bottom
C21  10nF  [0402]  29.25,85.92 0 bottom
C22  0.1uF  [0402]  36.2,72.2 270 bottom
C23  0.1uF  [0402]  22.8,72 270 bottom
C24  10nF  [0402]  48.75,74.35 0 bottom
C25  10nF  [0402]  31.52,89.4 90 bottom
C26  10uF  [1206]  25.2,81.9 0 top
C27  10uF  [1206]  26.57,93.45 90 top
C28  4.7nF  [0402]  38.1,35 270 bottom
C29  4.7nF  [0402]  34.7,33.8 0 bottom
C30  0.1uF  [0402]  24.24,79.88 0 bottom
C31  0.1uF  [0402]  23.55,90.55 270 top
C32  0.1uF  [0402]  37,35 270 bottom
C33  0.1uF  [0402]  34.7,32.6 0 bottom
C34  10uF  [1206]  53.4,66.65 0 bottom
C35  10uF  [1206]  55.35,75.15 180 bottom
C36  10uF  [1206]  33.7,79 0 bottom
C37  10uF  [1206]  35.95,87.8 180 bottom
C38  47nF  [0402]  47.1,72.6 180 top
C39  47nF  [0402]  26.77,85.5 180 top
C40  1uF  [0805]  51.9,69.8 270 bottom
C41  0.1uF  [0402]  56.05,73.3 180 bottom
C42  1uF  [0805]  32.4,82.15 270 bottom
C43  0.1uF  [0402]  36.75,85.9 180 bottom
C44  0.1uF  [0402]  46.65,73.9 180 top
C45  0.1uF  [0402]  26.97,86.8 180 top
C46  0.1uF  [0402]  50.3,69.55 270 bottom
C47  0.1uF  [0402]  30.83,82.33 270 bottom
C48  0.1uF  [0402]  48.75,75.5 0 bottom
C49  0.1uF  [0402]  29.2,82.55 0 bottom
C50  10nF  [0402]  48.65,70.9 0 bottom
C51  10nF  [0402]  29.2,83.7 0 bottom
C52  0.1uF  [0402]  22,64.8 180 top
C53  0.1uF  [0402]  48.65,69.75 0 bottom
C54  0.1uF  [0402]  29.25,88.15 0 bottom
C55  0.1uF  [0402]  53.55,69.35 270 bottom
C56  0.1uF  [0402]  34.12,82.17 270 bottom
C57  10nF  [0402]  48.75,76.6 0 bottom
C58  10nF  [0402]  29.25,89.25 0 bottom
C59  10uF  [0805]  22.8,43.1 180 bottom
C60  0.1uF  [0402]  55.05,77.6 90 bottom
C61  0.1uF  [0402]  35.2,90.22 90 bottom
C62  10uF  [0805]  28.4,39.6 90 bottom
C63  0.1uF  [0402]  48.75,72.1 0 bottom
C64  1uF  [0805]  56.8,80.05 270 bottom
C65  0.1uF  [0402]  29.25,84.83 0 bottom
C66  1uF  [0805]  38.84,90.91 0 bottom
C67  0.1uF  [0402]  49.95,77.54 0 top
C68  0.1uF  [0402]  30.5,90.5 0 top
C69  10uF  [0805]  22.9,51.3 180 bottom
C70  10uF  [1206]  44.25,69.1 180 bottom
C71  10uF  [1206]  60.4,78.35 0 bottom
C72  10uF  [1206]  24.8,81.92 180 bottom
C73  10uF  [1206]  39.4,93.5 0 bottom
C74  1uF  [0805]  39.1,67.9 180 bottom
C75  1uF  [0805]  52.05,79.45 270 top
C76  1uF  [0805]  32.8,92.15 270 top
C77  10uF  [0805]  28.1,54.8 270 bottom
C78  0.1uF  [0402]  56.86,36.92 0 top
C79  10uF  [1206]  54.65,80.7 270 top
C80  10uF  [1206]  35.35,93.7 270 top
C81  10uF  [1206]  30.7,46.1 90 bottom
C82  10nF  [0402]  57.85,29.68 180 top
C83  0.1uF  [0402]  29.7,54.8 270 bottom
C84  0.1uF  [0402]  22.9,49.3 180 bottom
C85  0.1uF  [0402]  30.1,39.5 90 bottom
C86  0.1uF  [0402]  56.05,72.05 180 bottom
C87  0.1uF  [0402]  36.75,84.65 180 bottom
C88  1uF  [0805]  29.4,64.9 45 bottom
C89  0.1uF  [0402]  39,70.3 0 bottom
C90  0.1uF  [0402]  22.8,44.8 180 bottom
C91  10uF  [1206]  56.8,70.1 180 bottom
C92  10uF  [1206]  37.4,82.45 180 bottom
C93  0.1uF  [0402]  32.5,57.2 45 bottom
C94  47uF  [1210]  45.7,92.9 0 top
C95  10uF  [0805]  31.8,39.6 90 bottom
C96  10uF  [0805]  34.4,59.3 315 bottom
C97  47uF  [1210]  41.3,93.9 90 top
C98  47uF  [1210]  45.65,87.52 0 top
C99  0.1uF  [0402]  32.8,61.9 315 bottom
C100  0.1uF  [0402]  32.6,43.4 270 bottom
C101  10uF  [0805]  30.5,51.8 0 bottom
C102  47uF  [1210]  44.3,83.65 0 top
C103  10uF  [0805]  29.1,58.9 135 bottom
C104  0.1uF  [0402]  27.3,64.7 225 top
C105  10uF  [0805]  27.9,63.4 45 bottom
C106  10uF  [1206]  42.1,85.75 270 bottom
C107  0.1uF  [0402]  25.7,63.1 45 top
C108  10uF  [0805]  26.4,61.9 45 bottom
C109  10uF  [0805]  38.1,48.2 0 bottom
C110  0.1uF  [0402]  52,95.42 270 top
C111  0.1uF  [0402]  60.6,93.4 90 bottom
C112  0.1uF  [0402]  54.95,86.15 180 top
C113  10uF  [0805]  58.1,92.9 90 bottom
C114  0.1uF  [0402]  38.2,46.5 0 bottom
C115  0.1uF  [0402]  35.2,42.8 180 bottom
C116  10uF  [0805]  54.95,84.5 180 top
C117  10uF  [0805]  38.2,44.8 0 bottom
C118  10uF  [1206]  46.9,88.5 0 bottom
C119  10uF  [0805]  53.5,63.8 0 top
C120  10uF  [0805]  48,64.1 0 top
C121  10uF  [0805]  43.5,64.1 180 top
C122  10nF  [0402]  51.6,56.4 180 top
C123  10nF  [0402]  46.1,56.7 180 top
C124  10nF  [0402]  40.5,56.7 180 top
C125  10uF  [0805]  53,54.6 0 top
C126  10uF  [0805]  47.5,54.9 0 top
C127  10uF  [0805]  42.9,54.9 180 top
C128  0.1uF, 500V  [1210]  71.6,94.5 180 top
C129  0.1uF, 500V  [1210]  71.6,31.5 180 top
C130  47uF  [1210]  53.4,50.3 0 top
C131  47uF  [1210]  45.4,50.4 180 top
C132  0.1uF  [0402]  68.8,79.4 270 bottom
C133  33uF  [1411-VISHAY-B]  73.7,89.3 90 bottom
C134  0.1uF  [0402]  72.07,83.53 270 bottom
C135  0.1uF  [0402]  73.33,81.57 90 bottom
C136  33uF  [1411-VISHAY-B]  68,87.5 90 bottom
C137  0.1uF  [0402]  63.2,87.7 270 bottom
C138  0.1uF  [0402]  64.4,87.7 270 bottom
C139  10uF  [1206]  40.7,42.6 90 top
C140  10uF  [1206]  58.8,42.2 90 top
D1  SESD0402X1UN-0020-090  [0402P-DFN]  6.1,78.2 0 top
D2  SESD0402X1UN-0020-090  [0402P-DFN]  5.9,83.6 0 top
D3  BAR66  [SOT23]  13.5,65.07 180 top
D4  BAR66  [SOT23]  27.3,68.9 90 top
D5  BAR66  [SOT23]  13.5,68.9 90 top
D6  KDZ4.3B  [SOD123]  19.7,65.9 270 top
F1  C014F-2  [1812]  7.9,75.4 0 top
F2  C014F-2  [1812]  7.9,71.6 0 top
F3  C014F-2  [1812]  7.9,67.8 0 top
J1  SMA002  [MMCX-THRU]  2.1,81 90 top
J2  SMA002  [MMCX-THRU]  2.1,86 90 top
J3  SMA002  [MMCX-THRU]  2.1,76 90 top
J4  SMA002  [MMCX-THRU]  2.1,71.5 90 top
J5  SMA002  [MMCX-THRU]  2.1,67 90 top
J6  FTSH-105-01-F-D-RA-K  [FTSH-105-01-F-D-RA-K]  46.87,35.63 180 bottom
J7  12226-8250-00FR  [12226-82X0-00XX]  4.7,51 270 top
J8  FMC_SINGLE_WIDTH_MODULE  [FMC_SINGLE_WIDTH_MODULE]  65.6,31.5 0 top
J9  ASP-134488-01  [FMC_HPC_MALE]  67.6,63 270 top
J10  BM08B-SURS-TF  [BM08B-SURS-TF]  58.6,58.9 90 top
L1  1008PS-472  [1008PS]  6.4,80.7 0 top
L2  1008PS-472  [1008PS]  6.3,86.1 0 top
L3  BLM18KG601SN1D  [0603]  49.5,80.55 270 bottom
L4  BLM18KG601SN1D  [0603]  29.67,93.45 270 bottom
L5  SRNxx-101M  [SRN6045TA]  15.1,80.9 270 top
L6  SRNxx-101M  [SRN6045TA]  17,88.8 270 top
L7  MPZ2012S102AT000  [0805]  22.9,79.2 180 top
L8  MPZ2012S102AT000  [0805]  22.43,93.13 180 top
L9  BLM18KG601SN1D  [0603]  44.7,71.2 180 bottom
L10  BLM18KG601SN1D  [0603]  25.37,83.97 180 bottom
L11  BLM18KG601SN1D  [0603]  54.55,80.5 270 bottom
L12  BLM18KG601SN1D  [0603]  35.2,93 270 bottom
L13  1277AS-H-6R8M=P2  [1210]  45.85,82.4 180 bottom
L14  BLM15PX601SN1D  [0402]  34.5,50.2 180 bottom
L15  BLM15PX601SN1D  [0402]  31.6,66.4 45 top
L16  BLM15PX601SN1D  [0402]  32.5,65.5 45 top
L17  BLM15PX601SN1D  [0402]  57.9,50.9 270 top
L18  BLM15PX601SN1D  [0402]  56.6,50.9 270 top
L19  BLM15PX601SN1D  [0402]  48.6,51 270 top
Q1  SI1012R  [SC75]  31.1,69.5 90 top
Q2  SI1012R  [SC75]  17.4,69.5 90 top
R1  3k  [0402]  26.2,72.2 270 top
R2  3k  [0402]  12.3,71.8 270 top
R3  2k  [0402]  9.1,79.6 270 top
R4  2k  [0402]  9,85.7 270 top
R5  150,0.25W  [0603]  27.9,72.2 90 top
R6  150,0.25W  [0603]  18,72.2 90 top
R7  150,0.25W  [0603]  29.8,72.2 90 top
R8  150,0.25W  [0603]  14.2,72.2 90 top
R9  2k  [0402]  10.2,82.2 180 top
R10  2k  [0402]  14.4,93 270 top
R11  150,0.25W  [0603]  31.7,72.2 90 top
R12  150,0.25W  [0603]  16.1,72.2 90 top
R13  165k  [0402]  33.4,69.2 270 top
R14  165k  [0402]  19.6,69.4 270 top
R15  10k  [0402]  37.3,69.2 90 top
R16  10k  [0402]  23.5,69.4 90 top
R17  1k  [0402]  34.7,69.2 270 top
R18  1k  [0402]  20.9,69.4 270 top
R19  5.6k 1%  [0402]  49.1,79.8 90 top
R20  21k 1%  [0402]  49.1,82 90 top
R21  5.6k 1%  [0402]  29.39,92.66 90 top
R22  21k 1%  [0402]  29.39,94.95 90 top
R23  49.9  [0402]  33.4,72.2 270 top
R24  49.9  [0402]  19.7,72.2 270 top
R25  100  [0402]  31,32.9 270 bottom
R26  100  [0402]  31,30.4 90 bottom
R27  100  [0402]  36.8,30 90 bottom
R28  49.9  [0402]  44.8,72.6 180 top
R29  49.9  [0402]  24.9,85 270 top
R30  4.7k  [0402]  50.3,67.8 270 top
R31  4.7k  [0402]  30,80.5 270 top
R32  4.7k  [0402]  48.9,67.8 270 top
R33  4.7k  [0402]  28.7,80.5 270 top
R34  DNP  [0402]  50.4,79.8 90 top
R35  10k  [0402]  50.4,82 90 top
R36  DNP  [0402]  30.74,92.66 90 top
R37  10k  [0402]  30.74,94.95 90 top
R38  3k  [0402]  21.3,66.7 90 top
R39  3k  [0402]  22.6,66.7 90 top
R40  4.7k  [0402]  58.7,75.9 270 bottom
R41  1k  [0402]  58.2,61.5 180 bottom
R42  1k  [0402]  58.2,59.3 0 bottom
R43  4.7k  [0402]  39.6,89 0 bottom
R44  1k  [0402]  58.2,56 180 bottom
R45  1k  [0402]  58.2,58.2 180 bottom
R46  1k  [0402]  58.2,57.1 180 bottom
R47  1k  [0402]  58.2,60.4 180 bottom
R48  0  [0402]  32.2,55.4 180 bottom
R49  165k  [0402]  45.9,68.4 0 top
R50  165k  [0402]  40.2,79.2 0 top
R51  165k  [0402]  45.9,69.8 0 top
R52  165k  [0402]  40.2,77.9 0 top
R53  2.2k  [RN2X8-1506]  19.9,39 90 top
R54  2.2k  [RN2X8-1506]  19.9,44.1 90 top
R55  2.2k  [RN2X8-1506]  19.9,55.4 90 top
R56  2.2k  [RN2X8-1506]  19.9,50.4 90 top
R57  2k  [0402]  38.3,72.3 270 bottom
R58  2k  [0402]  39.7,72.3 270 bottom
R59  10k  [0402]  30.7,42.8 0 bottom
R60  3.48k  [0402]  50.63,95.42 90 top
R61  3.48k  [0402]  53.38,95.42 90 top
R62  649k  [0402]  54.75,95.42 90 top
R63  0  [0402]  35.2,45.4 0 bottom
R64  10k  [0402]  35.2,41.5 0 bottom
R65  10k  [0402]  39.1,42.2 90 bottom
R66  10k  [0402]  35.2,44.1 180 bottom
R67  10k  [0402]  58.4,85.3 270 top
R68  10k  [0402]  58.4,88.7 90 top
R69  2.2k  [0402]  60.3,91.6 180 bottom
R70  15k  [0402]  54.2,62 0 top
R71  4.7k  [0402]  51.9,62 0 top
R72  47k  [0402]  48.7,62.3 0 top
R73  4.7k  [0402]  46.4,62.3 0 top
R74  47k  [0402]  43.1,62.3 0 top
R75  4.7k  [0402]  40.8,62.3 0 top
R76  165k  [0402]  54.3,47.9 180 top
R77  178k  [0402]  46.5,47.9 180 top
R78  10k  [0402]  74.5,73.3 90 bottom
R79  10k  [0402]  68.9,73.3 90 bottom
R80  73.2k  [0402]  50.7,40.1 0 bottom
R81  73.2k  [0402]  48.4,40.1 180 bottom
S1  CHS-01TA  [DIP01-SMD-GULL]  42.3,65.85 270 bottom
S2  CHS-01TA  [DIP01-SMD-GULL]  23.2,77.7 270 bottom
S3  CHS-02TB  [CHS-02TB]  71.7,68.6 0 bottom
TP1  [B1,27]  22.56,60.25 270 bottom
TP2  [B1,27]  20.77,60.32 270 bottom
TP3  [B2,54]  25.6,47.5 0 bottom
TP4  [B1,27]  24.9,60.2 270 bottom
TP5  [B1,27]  14.7,69.1 0 bottom
TP6  [B1,27]  21.1,73.1 0 bottom
TP7  [B1,27]  34.1,73.2 0 bottom
TP8  [B2,54]  3.5,62.3 0 bottom
TP9  [B2,54]  72.3,94.9 0 bottom
TP10  [B2,54]  24,95.7 0 bottom
TP11  [B1,27]  69.3,94.6 270 bottom
TP12  [B1,27]  70.1,91.1 0 bottom
TP13  [B1,27]  48.8,93.9 0 bottom
TP14  [B1,27]  50.15,85.3 0 bottom
TP15  [B1,27]  19,60.5 0 bottom
TP16  [B1,27]  39.65,79.55 0 bottom
TP17  [B2,54]  5.1,35.3 0 bottom
TP18  [B2,54]  39.2,56.4 0 bottom
U1  SN74LVC2G34DCKR  [SC70]  17.3,66.4 180 top
U2  SN65LVDS9638DGN  [MSOP-8-PAD-3X3]  36,36.7 180 top
U3  FIN1032MTCX  [TSSOP-16]  34.1,31.6 0 top
U4  ADCMP600  [SOT-23-5]  36.2,72.2 270 top
U5  ADCMP600  [SOT-23-5]  22.5,72.2 270 top
U6  DG1412E  [QFN16-4X4MM]  16.3,57.4 0 top
U7  DG1412E  [QFN16-4X4MM]  16.3,50.5 0 top
U8  DG1412E  [QFN16-4X4MM]  16.2,43.7 0 top
U9  DS90UB934-Q1  [WQFN48-7X7-PAD]  52.4,73.05 180 top
U10  DS90UB934-Q1  [WQFN48-7X7-PAD]  33,85.8 180 top
U11  DS91M040  [WQFN32-5X5]  56.92,33.06 270 top
U12  AD5766BCPZ-RL7  [CP_40_7]  30,61.5 135 top
U13  MCP47FEB02A0-E/ST  [TSSOP-8]  39.6,70.9 0 top
U14  LM4132AMF-2.5/NOPBCT-ND  [SOT-23-5]  27.4,43.8 90 bottom
U15  AD7617BSTZ  [ST_80_2]  30.5,47.2 0 top
U16  AD5142BCPZ10  [TSSOP-16_4.4X5.0]  59.4,94.6 0 top
U17  LTM4622A  [BGA_5X5_625X625]  51.7,90.17 0 top
U19  TPS7A49  [PVSON-N8+4-3X3]  52.5,59.1 270 top
U20  TPS7A49  [PVSON-N8+4-3X3]  47,59.4 270 top
U21  TPS7A30  [PVSON-N8+4-3X3]  41.4,59.4 270 top
U22  24AA64ST  [TSSOP8]  71.6,76.6 270 bottom
U23  LTM8049_BGA  [LTM8049]  49.7,42.7 270 top
U24  TPS62061DSGT  [WSON8-2X2]  45.45,85.65 90 bottom
X2  OE-LOGO_7X5  [OE-LOGO-7X5]  72.6,34.5 270 bottom

## Tracks (layer width: path | path; a pad name or v marks a point on that pad's centre or on a via)
!ADC_CS  (via drill 0.2)
  Top/HighSpeed 0.2: U15.63 35.4,54.85 v35.4,56 | v63.6,53.9 64,53.9 J9.H13
  Highspeed2 0.2: v35.4,56 37.5,56 39.7,53.8 63.2,53.8 63.3,53.9 v63.6,53.9
!ADC_RESET  (via drill 0.2)
  Top/HighSpeed 0.09: v66.5,49.2 J9.F10
  Highspeed2 0.09: v66.5,49.2 65.9,48.6 42.3,48.6 41.2,47.5 41.2,45.3 40.2,44.3 37.6,44.3 v36.7,43.4
  Bottom/LowSpeed 0.09: v36.7,43.4 36.43,43.4 R66.2
!DAC_CS  (via drill 0.2)
  Top/HighSpeed 0.2: v36.68,59.6 33.67,59.6 U12.8 | J9.J16 63.15,57.25 v62.7,56.8
  Highspeed2 0.2: v62.7,56.8 61.9,56 41.33,56 37.73,59.6 v36.68,59.6
!DAC_RESET  (via drill 0.2)
  Top/HighSpeed 0.09: U12.3 v31.61,58.12 v31.62,58.12 | v66.5,54.3 66.52,54.3 J9.F14
  Highspeed2 0.09: v31.62,58.12 32.24,57.5 37,57.5 40.2,54.3 v66.5,54.3
!LINK_PWR_ADJ_CS  (via drill 0.2)
  Top/HighSpeed 0.09: v66.1,85.8 66.67,85.22 J9.F38 | v63.5,96.9 62.3,96.9 62.32,96.88 U16.16
  Highspeed2 0.09: v66.1,85.8 66.1,86 67,86.9 67,89.02 63.4,92.62 63.4,96.8 v63.5,96.9
!LINK_PWR_ADJ_RESET  (via drill 0.2)
  Top/HighSpeed 0.09: v67.6,84.5 68.14,83.95 J9.E37 | U16.2 56.47,96.15 v57.63,96.15
  Highspeed2 0.09: v67.6,84.5 67.2,84.9 66.51,84.9 65.8,85.6 64.5,86.9 64.5,88 63.8,88.7 63.8,89.66 62.7,90.76 62.7,94.8 62.3,95.2 62.3,96.15 v57.63,96.15
$N1
  Top/HighSpeed 0.18: R2.2 10,71.27 F2.2 | 12.43,71.4 R2.2 | R24.1 19.47,73.06 R6.2 16.4,73.06 R12.2 R8.2 14.1,73.06 R2.2 | R2.2 12.3,68.9
  Top/HighSpeed 0.4: F2.2 10.15,72.55 10.1,72.5 10.1,71.8 10.53,71.37 | 12.3,68.9 D5.3
$N2
  Top/HighSpeed 0.18: 16.7,64.7 16.7,65.45 U1.4 | U1.6 17.95,64.85 17.8,64.7 16.7,64.7 | 16.7,64.7 15.97,63.98 D3.3 13.47,64 12.4,64 11.47,65.08 11.47,66.62 10,68.1 | 10,68.1 10,68.4 10.1,68.5 10.1,67.9 F3.2 10,68.1 | 10,68.1
  Top/HighSpeed 0.4: 10,67.9 F3.2
$N3
  Top/HighSpeed 0.18: F1.2 10.5,75.4 11.55,74.35 24.2,74.35 25.2,73.35 25.2,72.1 25.63,71.67 R1.2 | 31.9,73.06 33.17,73.06 R23.1 arc90 33.07,73.06 R11.2 R7.2 R5.2 27.12,72.28 27.12,72.12 26.67,71.67 R1.2 | R1.2 26.07,71.54 | R1.2 D4.3 | D4.3
  Top/HighSpeed 0.4: D4.3 25.7,68.9 25.8,69 | 26.3,71.72 R1.2 26.18,71.7 | 10,76.7 | 10,76.7 F1.2
+1V8  (via drill 0.2)
  Top/HighSpeed 0.09: R21.1 29.25,91.99 v29.25,91.45 | 49.1,79.07 R19.1 49.1,78.5 v49.07,78.47 | v30.68,91.38 30.68,92.07 | R34.1 50.4,78.57 v50.28,78.45
  Top/HighSpeed 0.11: 30.68,92.07 R36.1
  Top/HighSpeed 0.2: 37,85.05 U10.17 | 56.35,72.3 U9.17
  Top/HighSpeed 0.4: v38,84.9 37.85,85.05 37,85.05 | v57.4,72.25 57.35,72.3 56.35,72.3
  Bottom/LowSpeed 0.09: TP16.TP 39.62,79.58 39.62,80.5
  Bottom/LowSpeed 0.2: 44.25,84.7 U24.4
  Bottom/LowSpeed 0.4: C106.2 42.5,84.5 43.8,84.5 44,84.7 44.25,84.7
  Bottom/LowSpeed 1: C106.2 41.78,81.75 40.53,80.5 39.62,80.5 39.61,80.5 39.2,80.5 39.05,80.65 C92.2 | L13.1 44.67,81.94 44.67,80.54 45.8,79.4 45.8,78
  other vias: 45.2,77.5 45.5,77.9 45.8,78.3 45.8,77.5 46.1,77.9 46.35,78.3 46.35,77.5 45.2,78.25 37.65,84.1 38.15,84.1 38.7,84.1 39.2,84.1 38.5,84.95 39.15,84.95 29.75,91.45 30.2,91.45 23,84.5 23.7,84.5 23.7,83.8 23,83.8 48.52,78.47 49.55,78.5 57.9,72.2 58.45,72.15 42.35,71.85 42.9,71.85 42.9,71.05 42.35,71.05
  pour Bottom/LowSpeed (no thermals): 37.1,85.2 37.1,83.4 38.4,83.4 38.4,81.5 39.5,81.5 39.5,85.2
  pour Bottom/LowSpeed (rank 2, no thermals): 45.05,77.25 46.75,77.25 46.75,78.75 45.05,78.75
  pour Bottom/LowSpeed (no thermals): 40.85,84.7 43.35,84.7 43.35,83.8 45.25,83.8 45.25,81.1 40.9,81.1
  pour Bottom/LowSpeed (no thermals): 44.3,70.55 44.3,72.25 42.1,72.25 42.1,70.55
  pour VCC: 42.1,70.45 58.2,70.45 58.9,71.15 58.9,72.45 55.5,72.45 55.5,76.25 50.7,76.25 50.7,79.15 45.05,79.15 45.05,77.25 48.3,77.25 48.3,72.15 42.1,72.15
  pour VCC: 22.7,83.2 38.8,83.2 39.5,83.9 39.5,85.2 36.1,85.2 36.1,89 31.3,89 31.3,91.7 28.9,91.7 28.9,84.9 22.7,84.9
  pour Bottom/LowSpeed (no thermals): 24.9,83.2 24.9,84.9 22.7,84.9 22.7,83.2
  pour Bottom/LowSpeed (no thermals): 31,91.1 28.9,91.1 28.87,93.12 30.47,93.12 31,92.59
  pour Bottom/LowSpeed (no thermals): 50.35,78.25 48.25,78.25 48.23,79.53 49.07,80.37 49.82,80.37 50.35,79.84
  pour Bottom/LowSpeed (no thermals): 56.5,72.45 56.5,70.65 58.8,70.65 58.8,72.45
+3V3  (via drill 0.2, 0.3, 0.4, 0.7)
  Top/HighSpeed 0.09: U3.4 32.37,31.93 v32.4,31.9 | 26.34,79.94 v26.3,79.9 26.35,79.95 28.68,79.95 R33.2 R31.2 30.17,79.97 30.9,80.7 31.2,80.7 31.75,81.25 U10.4 U10.5 | 50.3,67.2 R30.2 49.63,67.27 v49.6,67.3 49.57,67.27 R32.2 | 50.3,67.2 50.3,67 | U9.4 U9.5 51.65,68.55 50.3,67.2 | U16.1 56.42,96.9 v57.6,96.9
  Top/HighSpeed 0.2: U16.11 61.61,93.62 v61.29,93.95 61.62,94.28 U16.12
  Top/HighSpeed 0.3: v32.8,58.1 32.34,58.1 U12.4 | U1.5 17.3,66.2 17.4,66.3 v18.2,66.3 | U3.16 36.87,33.9 v35.9,33.9 | U2.1 39.07,35.73 v39.2,35.6 | C78.2 v57.39,36.11 arc90 v57.4,36.1 57.4,35.46 | 57.4,30.66 U11.29 | 57.4,30.66 57.4,29.76 arc-90 C82.2 57.24,29.6 v56.5,29.6 | U11.30 57.4,30.66 | U11.11 57.4,35.46 | 57.4,35.46 U11.12 | 56.43,96.85 U16.1
  Top/HighSpeed 0.4: U15.49 38.12,46.2 v36.8,46.2 | U23.L7 U23.K7 | U23.A7 U23.B7 | U13.1 38.63,68.87 v38.2,69.3 | U13.2 39.28,68.68 v39.8,69.2 | U4.5 36.55,73.15 v36.2,73.5 | v22.9,73.5 23.5,73.5 U5.5 | J9.F40 66.83,87.77 v67.6,87.1 | v61.4,88.4 61.4,88.25 J9.K40 62.55,87.1 | 62.55,87.1 v62.6,87.1 | J9.J39 62.55,87.1 | v67.5,85.8 68.19,86.5 J9.E39 | J9.H40 J9.G39 v66.3,87.1
  Bottom/LowSpeed 0.089: 23.11,77.73 S2.2
  Bottom/LowSpeed 0.09: R79.2 v68.9,74.4 | R78.2 v74.5,74.4 | R57.2 R58.2 40.13,71.77 v40.4,71.5 | R64.1 v36.3,41.5 | R63.1 35.73,45.97 v35.7,46 | v38.05,89.3 38.35,89 R43.2 | R40.2 59.98,75.37 60,75.35 | v41.35,67.12 42.3,66.17 S1.2 | v22,78.1 22.37,77.73 23.11,77.73 | R69.1 v59.2,91.6
  Bottom/LowSpeed 0.11: TP11.TP v68.8,93.6
  Bottom/LowSpeed 0.2: R65.1 39.1,41.2 v39.3,41 | U24.5 U24.6 U24.7 | C111.2 60.81,93.95 v61.29,93.95 | v35.9,33.9 35.8,33.8 C29.1
  Bottom/LowSpeed 0.3: C32.1 C28.1 38.1,35.6 v39.2,35.6 | C29.1 C33.1 | v18.2,66.3 17.83,66.3 C10.2 | C111.2 60.51,94.02 58.12,94.02 C113.2 58.33,94.17 | 59.2,94.02 59.3,94.12 v59.3,94.5
  Bottom/LowSpeed 0.4: 37.1,46.5 v36.8,46.2 | 37.1,46.5 C114.2 | C117.2 37.1,44.86 37.1,46.5 | C93.2 32.65,58.1 v32.8,58.1 33.26,58.56 C96.2 | C22.1 v36.2,73.5 | C89.2 38.2,70.03 v38.2,69.3 | v39.8,69.2 40.14,68.86 C74.2 | v22.9,73.5 22.9,72.63 C23.1 | C138.2 C137.2 63.13,87.1 v62.6,87.1 | C136.A 67.97,85.8 v67.5,85.8
  Bottom/LowSpeed 0.5: v43.7,90.9 43.7,89.25 44.45,88.5 C118.2
  Bottom/LowSpeed 0.7: L11.1 55.86,80.05 59.25,80.05 60,79.3 60,75.35 60,68.4 58.56,66.96 v57.55,66.96
  other vias: 35.65,93.05 35.15,93.05 34.65,93.05 40.5,39.7 42.4,40.7 42.5,39.6 41.6,39.7 56.9,40.2 59.2,39 58.1,39 56.9,39 42.4,41.5 56.9,41.3 65.1,87.1
  pour VCC (isolate 0.1, rank 3, no thermals): -9.4,98.5 -9.4,20.5 94.6,20.5 94.5,98.6
  pour Top/HighSpeed (no thermals): 44,42.1 44,38.5 40.9,38.5 40,39.4 40,41.7 41.8,41.7 42.2,42.1
  pour Top/HighSpeed (no thermals): 55.4,42.1 55.4,38.2 59.4,38.2 60,38.8 60,41.6 57.7,41.6 57.2,42.1
  pour Bottom/LowSpeed (no thermals): 34.35,92.7 34.4,94.45 36,94.45 35.95,92.7
  pour Bottom/LowSpeed (no thermals): 53.75,80.3 53.75,81.9 55.35,81.9 55.35,80.3
  pour Bottom/LowSpeed (no thermals): 44.6,89.4 44.6,87.6 45,87.35 45.55,87 45.55,86.5 46.3,86.5 46.3,89.4
  pour Bottom/LowSpeed (rank 2, no thermals): 62.4,87.6 62.4,86.5 66.5,86.5 66.5,84.9 69.6,84.9 69.6,87.6
+5V_AN  (via drill 0.2, 0.35, 0.4, 0.7)
  Top/HighSpeed 0.2: C107.2 26.25,63.48 U12.28
  Top/HighSpeed 0.4: U15.6 23.87,50.12 24.2,49.8 v24.2,49.7 | v29.7,40.82 29.8,40.72 29.87,40.72 30.17,40.41 U15.30 | U15.15 23.77,44.27 v24.2,44.7 | U15.71 30.17,53.88 v29.7,53.4 | C107.2 25.65,63.9 v25.5,63.9
  Bottom/LowSpeed 0.09: U14.3 26,44.8 v25.3,44.8
  Bottom/LowSpeed 0.2: 25.14,62.64 C108.2 25.47,62.45 25.4,62.45 | v23.18,58.14 22.56,58.76 TP1.TP
  Bottom/LowSpeed 0.4: 29.7,53.8 v29.7,53.4 | C83.2 29.7,53.8 | C77.2 29.66,53.76 29.7,53.8 | 24.1,44.8 C90.2 | 24.1,44.8 v24.2,44.7 | C59.2 24.1,43.36 24.1,44.8 | C62.2 28.58,40.82 v29.7,40.82 30.1,40.42 C85.2 | C69.2 24.2,50.84 v24.2,49.7 23.8,49.3 C84.2 | v25.5,63.9 25.5,62.55 25.4,62.45 | U14.4 30.4,44.75 C81.1 29.9,45.25 v29.9,45.4
  Bottom/LowSpeed 0.7: L14.1 v31.7,50.2
  pour VCC (isolate 0.1, no thermals): 23,40 23,62.4 24.9,64.3 27.6,64.3 27.6,56 30.6,56 30.6,51.5 32.6,51.5 32.6,49 30.3,49 30.3,40
+12V  (via drill 0.2, 0.3, 0.4, 0.7)
  Top/HighSpeed 0.4: 22,67.23 R39.2 R38.2 21.1,67.43 v21.1,67.6 | 8.9,58.94 J7.26 | J9.C37 70.84,83.95 v71.3,83.5 71.3,83.02 71.38,82.94 71.38,82.43 71.3,82.35 v71.3,82 70.77,81.47 J9.C35 | J7.1 9.64,43.06 8.1,44.6
  Top/HighSpeed 0.7: 8.1,44.6 8.1,58.14 8.9,58.94
  Top/HighSpeed 1: 50.95,86.75 47.62,83.42 47.62,81.92 v43.8,78.1
  Highspeed2 0.4: 15.2,71.9 19.5,67.6 v21.1,67.6
  Highspeed2 1: v12.2,59.8 12.2,68.9 15.2,71.9 17.71,74.41 23.28,74.41 23.28,74.4 25.82,74.4 25.82,74.41 26.58,74.41 26.58,74.4 35.82,74.4 35.82,74.41 40.11,74.41 v43.8,78.1
  Bottom/LowSpeed 0.09: TP12.TP 69.3,91.1 69.3,91.8
  Bottom/LowSpeed 0.4: C135.2 C134.2
  Bottom/LowSpeed 0.406: v51.08,88.3 v51.08,92.05
  Bottom/LowSpeed 1: 63.88,91.8 67.58,91.8
  Bottom/LowSpeed 1.5: 67.58,91.8 69.3,91.8 73,88.1 | v51.6,86.8 52.04,87.25 56.93,87.25 59.65,89.96 62.04,89.96 63.88,91.8
  other vias: 50.6,87 50.6,86.5 51.2,86.5 51.1,87 51,87.7 51.7,88.28 50.4,88.2 51.9,86.5
  pour Top/HighSpeed (rank 2, no thermals): 50.2,91.17 51.95,91.17 51.95,91.67 50.45,93.17 50.2,93.17
  pour Top/HighSpeed (no thermals): 50.2,89.2 50.2,86.3 52.9,83.6 54.7,83.6 54.7,87.3 52.5,87.3 52.5,89.2
  pour Top/HighSpeed (no thermals): 13.4,58.8 8.6,58.8 8.6,60.1 13.4,60.1
  pour Bottom/LowSpeed (no thermals): 71.1,83.7 72.9,83.7 72.9,88.8 74.1,88.8 74.1,81.7 71.1,81.7
+13V_AN  (via drill 0.2, 0.4)
  Top/HighSpeed 0.2: U12.26 27.02,64.12 C104.2 | v18.62,57.59 18.48,57.73 U6.11 | U7.11 18,50.83 v17.88,50.94 | U8.11 v18.12,43.84
  Top/HighSpeed 0.4: C104.2 26.5,64.75 v26.5,64.9 26.5,65.6 27.4,66.5 27.73,66.5 27.75,66.51 30.3,66.51 30.79,66.02 L15.1
  VCC 0.2: 19.6,56.7 19.36,56.7 18.62,57.44 v18.62,57.59 | v17.88,50.94 17.34,50.94 17.3,50.9 | v18.12,43.84 17.46,43.84 17.3,44
  VCC 0.4: 19.6,56.7 v21.45,58.55 21.45,60.75 25.6,64.9 v26.5,64.9 | 18.35,55.45 18.29,55.39 18.29,53.17 17.3,52.19 17.3,50.9 17.3,44
  VCC 0.406: 19.6,56.7 18.35,55.45
  Bottom/LowSpeed 0.2: C105.2 26.9,64.4 26.9,64.6 | C9.2 17.17,43.7 18.12,43.7 v18.12,43.84 | v18.62,57.59 18.77,57.43 C7.2 | C8.2 17.47,50.53 v17.88,50.94 | TP2.TP 20.77,59.23 v21.45,58.55
  Bottom/LowSpeed 0.4: 27.16,64.34 26.9,64.6 v26.5,64.9
+15V
  Top/HighSpeed 1: C130.2 54.63,50.46
  pour Top/HighSpeed (no thermals): 58.2,44.8 54.3,44.8 54.3,51.7 55.8,51.7 55.8,50.7 58.2,50.7
-13V_AN  (via drill 0.2, 0.4)
  Top/HighSpeed 0.15: v16.14,43.7 U8.PAD | U12.PAD v28.95,61.5
  Top/HighSpeed 0.2: 15.65,57.95 16.2,57.4 | 15.65,57.95 v15.6,58 | v13.8,57.6 13.92,57.73 U6.2 | U6.PAD 15.75,57.95 15.65,57.95 | U8.2 14.11,44.02 v13.94,44.2
  Top/HighSpeed 0.203: v13.9,50.81 U7.2
  Top/HighSpeed 0.3: U12.6 31.4,60.45 31.4,60.5 31.3,60.5
  Top/HighSpeed 0.4: 31.4,60.5 v31.95,60.7 | v32.6,64.3 32.6,64.65 L16.1
  VCC 0.2: 14.69,50.51 arc-90 14.7,50.5 | v16.14,43.7 15.1,43.7 | v13.8,57.6 14.2,57.6 15,56.8 15.1,56.8 | v15.6,58 15.9,57.7 16,57.7 | v13.94,44.2 14.6,44.2 14.7,44.1
  VCC 0.203: v13.9,50.81 14.61,50.81 14.7,50.9 | 14.7,50.5 U7.PAD
  VCC 0.4: v32.6,64.3 30.39,66.51 26.46,66.51 20.7,60.75 19.76,60.75 18.61,59.6 18.19,59.6 17.9,59.6 16,57.7 15.1,56.8 14.9,56.6 14.9,55.11 14.9,55 14.7,54.8 14.7,50.9 14.7,50.5 14.7,44.1 15.1,43.7
  Bottom/LowSpeed 0.19: 31,62.7 30.1,62.7 v30,62.6
  Bottom/LowSpeed 0.2: v13.94,44.2 14.73,43.7 C19.2 | 24.8,60.1 TP4.TP 25.11,60.19 25.3,60 27.4,60 28,60.6 v28.05,60.6 | C17.2 13.03,57.6 v13.8,57.6 15.2,57.6 v15.6,58
  Bottom/LowSpeed 0.203: C18.2 14.18,50.53 v13.9,50.81
  Bottom/LowSpeed 0.4: v32.6,64.3 31,62.7
  other vias: 31.1,61.5 31.9,62.3 30.85,59.6 29.1,59.5 30,60.4 16.3,50.5 30.75,63.35
  pour Bottom/LowSpeed (no thermals): 27.7,60.7 30.8,63.8 33.1,61.5 30,58.4
-15V
  pour Top/HighSpeed (no thermals): 49.1,44.6 49.1,50.7 46.5,50.7 46.5,45.9 45.2,45.9 45.2,44.6
ADC_BUSY  (via drill 0.2)
  Top/HighSpeed 0.2: v62.6,52.5 62.86,52.5 J9.J12 | v33.2,53.4 32.77,53.83 U15.67
  Highspeed2 0.2: v33.2,53.4 34.6,52 62.1,52 v62.6,52.5
ADC_CONVST  (via drill 0.2)
  Top/HighSpeed 0.2: U15.68 32.12,53.98 v32.3,53.8 | J9.K13 61.61,53.2 v60.9,53.2
  Highspeed2 0.2: v32.3,53.8 33.2,54.7 37.7,54.7 39.2,53.2 v60.9,53.2
ADC_MISO_A  (via drill 0.2)
  Top/HighSpeed 0.2: U15.57 38.15,51.4 v39.3,51.4 | J9.K11 61.56,50.94 v61.3,51.2
  Highspeed2 0.2: v61.3,51.2 61.1,51.4 v39.3,51.4
ADC_MISO_B  (via drill 0.2)
  Top/HighSpeed 0.2: U15.56 38.15,50.8 v39.3,50.8 | J9.J10 63.15,49.75 v62.8,50.1
  Highspeed2 0.2: v39.3,50.8 61.13,50.8 62.1,50.8 v62.8,50.1
ADC_MOSI  (via drill 0.2)
  Top/HighSpeed 0.2: U15.55 38.15,50.1 v39.3,50.1 | J9.K10 61.5,50.05 v61.5,50.1
  Highspeed2 0.2: v39.3,50.1 v61.5,50.1
ADC_SCLK  (via drill 0.2)
  Top/HighSpeed 0.2: U15.62 36,54.8 v36,53.7 | J9.J13 62.88,53.2 v62.6,53.2
  Highspeed2 0.2: v36,53.7 36,53.63 37.03,52.6 61.7,52.6 62.3,53.2 v62.6,53.2
ADDR0  (via drill 0.2)
  Top/HighSpeed 0.09: 70.85,71.25 J9.C27 71.25,71.25 v71.4,71.4
  Bottom/LowSpeed 0.09: R78.1 72.69,72.77 S3.4 72.33,72.34 v71.4,71.4
ADDR1  (via drill 0.2)
  Top/HighSpeed 0.09: v70.3,70.5 70.77,70.03 J9.C26
  Bottom/LowSpeed 0.09: v70.3,70.5 70.3,72.41 | 70.3,72.41 S3.3 | 70.3,72.41 69.26,72.41 R79.1
AGND  (via drill 0.2, 0.35, 0.4, 0.7)
  Top/HighSpeed 0.09: R54.C1 v19.9,41.5
  Top/HighSpeed 0.15: 27.69,64.9 C104.1 | v13.8,56.9 13.92,57.02 13.96,57.02 14.01,57.08 U6.3
  Top/HighSpeed 0.2: v27.2,65.5 27.72,64.98 C104.1 | U12.29 26.36,62.66 25.38,62.66 C107.1 | U12.25 27.69,64.16 | 14.13,43.38 U8.3
  Top/HighSpeed 0.3: U12.31 26.28,61.02 v25.8,61.5 | U12.20 30.48,65.32 v30.1,65.7 | U12.10 34,61.36 v34,61.5 | J7.14
  Top/HighSpeed 0.4: v21.53,50.3 21.53,50.53 21.77,50.77 U15.5 | U15.29 29.52,38.48 v29.7,38.2 | U15.16 21.87,43.62 21.5,44 v21.5,44.3 | U15.72 29.52,56.3 v29.5,56.3 | U15.34 32.8,39.58 32.8,38.7 v31.63,37.57 | U15.69 31.47,53.23 v31.6,53.1 | C107.1 25.05,63 v24.6,63 | U15.32 31.47,38.58 31,38.1 v30.6,38.1
  Bottom/LowSpeed 0.09: v25.6,49.1 TP3.TP
  Bottom/LowSpeed 0.15: C18.1 14.46,50.01 v14.12,50.01
  Bottom/LowSpeed 0.2: v13.8,56.9 13.47,56.57 C17.1 | v18,48.86 17.8,49.06 C8.1 | C9.1 17,42.1 v17.8,41.3 | C7.1 19.09,56.15 19.07,55.99 19.07,54.8 v18.89,54.62 | C19.1 14.9,42.35 v14.1,41.55
  Bottom/LowSpeed 0.3: 26.6,61.16 26.14,61.16 v25.8,61.5 | 30.14,64.9 30.14,65.66 v30.1,65.7 | C99.1 33.95,61.5 v34,61.5
  Bottom/LowSpeed 0.4: C83.1 29.5,55.53 29.5,55.8 | v29.5,56.3 29.5,55.8 | 29.5,55.8 28.14,55.8 C77.1 | C101.1 31.54,53.04 v31.6,53.1 | C84.1 22.33,49.3 v21.53,50.3 21.53,50.97 C69.1 | C90.1 22,44.8 v21.5,44.3 21.5,43.36 C59.1 | C85.1 30.1,38.5 30.04,38.56 29.9,38.56 | 29.9,38.56 C62.1 | v29.7,38.2 29.8,38.46 29.9,38.56 | 31.56,38.46 31.56,38.56 C95.1 31.16,38.56 v30.6,38.1 | C81.2 30.7,46.85 v30.75,46.8 | v28.2,57.1 C103.1 | C100.1 v32.6,44.8 | v25.2,43.8 U14.2
  Bottom/LowSpeed 0.7: R48.1 31.67,55.81 v31.2,56.27
  Bottom/LowSpeed 1: 30.14,64.9 C88.1 C105.1 C108.1 26.6,61.16
  other vias: 19.85,40.1 19.85,38.65 19.9,36.95 29.9,49.75 25.05,41.65 13.9,59.3 22,62.9 25.9,66.7 19.1,62.9 23.8,64.6 30.8,37.1 32.7,47.8 17.5,37.85 15.2,40.15 10,50.75 10,52.2 10,55 10,56.1 10,58.3 19.9,47.2 19.9,52.3 18.7,46.4 14.4,59.8 15.1,60.5 16.9,62.3 35.5,62.5 34.3,63.6 34.9,61.9 14.05,46.6 14.18,48.65 17.75,55
  pour Top/HighSpeed (rank 2): 9.7,50.4 13.3,50.4 13.6,50.1 13.6,43.9 10.4,43.9 10.4,43.5 13.6,43.5 13.6,41.5 18.4,36.7 31.5,36.7 33.3,38.5 33.3,52.5 32,53.8 32,56.3 30.1,58.2 33.3,61.4 34,60.7 35.7,62.5 31.29,66.91 25.82,66.89 22,63 17.4,63 13.7,59.3 13.7,58.6 9.7,58.6
  pour GND3 (isolate 0.1, no thermals): 9.7,50.4 13.3,50.4 13.6,50.1 13.6,41.5 18.4,36.7 31.5,36.7 33.3,38.5 33.3,52.5 32,53.8 32,56.3 30.1,58.2 33.3,61.4 34,60.7 35.7,62.5 31.29,66.91 25.82,66.89 22,63 17.4,63 13.7,59.3 13.7,58.6 9.7,58.6
  pour VCC (isolate 0.1, rank 2, no thermals): 9.7,50.4 13.3,50.4 13.6,50.1 13.6,41.5 18.4,36.7 31.5,36.7 33.3,38.5 33.3,52.5 32,53.8 32,56.3 30.1,58.2 33.3,61.4 34,60.7 35.7,62.5 31.29,66.91 25.82,66.89 22,63 17.4,63 13.7,59.3 13.7,58.6 9.7,58.6
  cutout GND1 (isolate 0.1, rank 2, no thermals): 9.7,50.4 13.3,50.4 13.6,50.1 13.6,41.5 18.4,36.7 31.5,36.7 33.3,38.5 33.3,52.5 32,53.8 32,56.3 30.1,58.2 33.3,61.4 34,60.7 35.7,62.5 31.29,66.91 25.82,66.89 22,63 17.4,63 13.7,59.3 13.7,58.6 9.7,58.6
AIN_AOUT0  (via drill 0.2)
  Top/HighSpeed 0.09: J9.F11 66.63,50.6 v66.4,50.6 | U8.15 15.87,45.42 v15.75,45.29
  Bottom/LowSpeed 0.09: v66.4,50.6 61.4,50.6 56.2,45.4 56.2,40.4 54,38.2 36,38.2 33,35.2 32.8,34.99 32.51,34.99 32.51,35 18.3,35 13.3,40 13.3,45.2 13.9,45.8 15.24,45.8 v15.75,45.29
AIN_AOUT1  (via drill 0.2)
  Top/HighSpeed 0.09: v68.9,51.1 69.5,51.1 J9.D11 | U8.6 15.87,41.12 v15.9,41.1
  Bottom/LowSpeed 0.09: v68.9,51.1 67.7,51.1 67.25,51.55 60.75,51.55 54.8,45.6 54.8,40.1 53.2,38.5 35.3,38.5 32.8,36.01 32.1,36.01 32.09,36 17.7,36 16.2,37.5 16.2,40.8 v15.9,41.1
AIN_AOUT2  (via drill 0.2)
  Top/HighSpeed 0.09: J9.E12 67.91,52.2 v67.7,52 | U8.7 v16.54,41.06
  Bottom/LowSpeed 0.09: v67.7,52 59.9,52 53.3,45.4 53.3,40 52.05,38.75 34.46,38.75 32.96,37.25 32.15,37.25 31.24,36.35 31.2,36.35 17.85,36.25 16.8,37.3 16.8,40.8 v16.54,41.06
AIN_AOUT3  (via drill 0.2)
  Top/HighSpeed 0.09: v64,49.3 64.36,49.66 J9.H10 | U8.14 16.52,46.08 v16.5,46.1
  Bottom/LowSpeed 0.09: v16.5,46.1 13.7,46.1 12.9,45.3 12.9,40 18.2,34.7 32.9,34.7 36.1,37.9 56.7,37.9 57.6,38.8 57.6,45.2 61.7,49.3 v64,49.3
AIN_AOUT4  (via drill 0.2)
  Top/HighSpeed 0.09: v67.7,59.5 67.91,59.5 J9.E18 | v16,53 16,52.45 U7.15
  Bottom/LowSpeed 0.09: v67.7,59.5 67.3,59.9 67.3,62.8 66.05,64.05 39.07,64.05 33.5,69.62 24.42,69.62 20.2,65.4 17.85,65.4 17.84,65.39 16.96,65.39 16.95,65.4 14.7,65.4 8.4,59.1 8.4,54.7 10.1,53 v16,53
AIN_AOUT5  (via drill 0.2)
  Top/HighSpeed 0.09: v62.6,48 62.99,48.39 J9.J9 | v16.02,47.92 16.02,48.53 U7.6
  Bottom/LowSpeed 0.09: v62.6,48 60.15,45.55 60.15,38.75 58.7,37.3 36.3,37.3 33.1,34.1 18,34.1 12.3,39.8 12.3,46 13.67,47.37 15.66,47.37 16.02,47.73 v16.02,47.92
AIN_AOUT6  (via drill 0.2)
  Top/HighSpeed 0.09: v65.3,49.2 65.69,49.59 J9.G10 | U7.7 16.6,48.55 v16.6,47.92
  Bottom/LowSpeed 0.09: v65.3,49.2 64.9,48.8 62.3,48.8 58.85,45.35 58.85,42.46 58.6,42.21 58.6,38.4 57.8,37.6 36.2,37.6 33,34.4 18.1,34.4 12.6,39.9 12.6,45.7 13.85,46.95 15.85,46.95 16.6,47.7 v16.6,47.92
AIN_AOUT7  (via drill 0.2)
  Top/HighSpeed 0.09: v66.6,59 66.96,58.64 J9.F17 | U7.14 16.62,52.98 v16.6,53